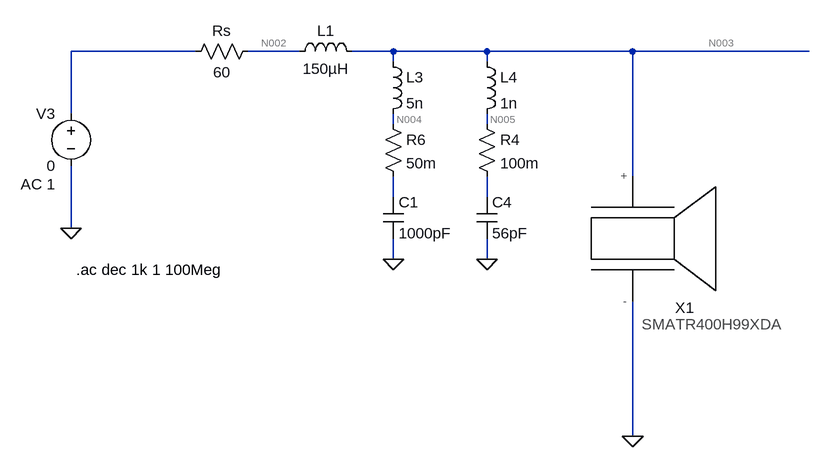
[diagram p0: schematic SMATR400H99XDA_Frequency_Response.asc]
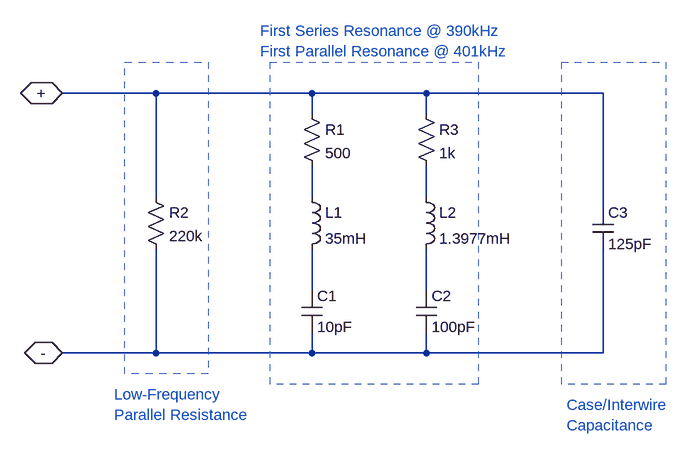
[diagram p1: sub-circuit smatr400h99xda.asc]
SMATR400H99XDA_Frequency_Response.asc, the LTspice schematic file:
Version 4
SHEET 1 4624 2852
WIRE -624 -128 -816 -128
WIRE -464 -128 -544 -128
WIRE -320 -128 -384 -128
WIRE -176 -128 -320 -128
WIRE 48 -128 -176 -128
WIRE 320 -128 48 -128
WIRE -320 -112 -320 -128
WIRE -176 -112 -176 -128
WIRE -816 -32 -816 -128
WIRE -320 -16 -320 -32
WIRE -176 -16 -176 -32
WIRE 48 64 48 -128
WIRE -320 96 -320 64
WIRE -176 96 -176 64
WIRE -816 144 -816 48
WIRE -320 192 -320 160
WIRE -176 192 -176 160
WIRE 48 464 48 256
FLAG 48 464 0
FLAG -816 144 0
FLAG -320 192 0
FLAG -176 192 0
SYMBOL SMATR400H99XDA 48 160 R0
SYMATTR InstName X1
SYMBOL voltage -816 -48 M0
WINDOW 123 24 124 Left 2
WINDOW 39 0 0 Left 0
SYMATTR Value2 AC 1
SYMATTR InstName V3
SYMATTR Value 0
SYMBOL cap -336 96 R0
SYMATTR InstName C1
SYMATTR Value 1000pF
SYMBOL ind -480 -112 R270
WINDOW 0 32 56 VTop 2
WINDOW 3 5 56 VBottom 2
SYMATTR InstName L1
SYMATTR Value 150µH
SYMBOL cap -192 96 R0
SYMATTR InstName C4
SYMATTR Value 56pF
SYMBOL ind -336 -128 R0
SYMATTR InstName L3
SYMATTR Value 5n
SYMBOL ind -192 -128 R0
SYMATTR InstName L4
SYMATTR Value 1n
SYMBOL res -192 -32 R0
SYMATTR InstName R4
SYMATTR Value 100m
SYMBOL res -336 -32 R0
SYMATTR InstName R6
SYMATTR Value 50m
SYMBOL res -640 -112 R270
WINDOW 0 32 56 VTop 2
WINDOW 3 0 56 VBottom 2
SYMATTR InstName Rs
SYMATTR Value 60
TEXT -808 208 Left 2 !.ac dec 1k 1 100Meg

smatr400h99xda.asc, the sub-circuit schematic file:
Version 4
SHEET 1 880 680
WIRE -160 -96 -304 -96
WIRE 80 -96 -160 -96
WIRE 256 -96 80 -96
WIRE 528 -96 256 -96
WIRE 80 -64 80 -96
WIRE 256 -64 256 -96
WIRE -160 64 -160 -96
WIRE 80 64 80 16
WIRE 256 64 256 16
WIRE 528 80 528 -96
WIRE 80 208 80 144
WIRE 256 208 256 144
WIRE -160 304 -160 144
WIRE -160 304 -304 304
WIRE 80 304 80 272
WIRE 80 304 -160 304
WIRE 256 304 256 272
WIRE 256 304 80 304
WIRE 528 304 528 144
WIRE 528 304 256 304
FLAG -304 -96 +
IOPIN -304 -96 BiDir
FLAG -304 304 -
IOPIN -304 304 BiDir
SYMBOL ind 64 48 R0
SYMATTR InstName L1
SYMATTR Value 35mH
SYMBOL res 64 -80 R0
SYMATTR InstName R1
SYMATTR Value 500
SYMBOL cap 64 208 R0
SYMATTR InstName C1
SYMATTR Value 10pF
SYMBOL res -176 48 R0
SYMATTR InstName R2
SYMATTR Value 220k
SYMBOL cap 240 208 R0
SYMATTR InstName C2
SYMATTR Value 100pF
SYMBOL res 240 -80 R0
SYMATTR InstName R3
SYMATTR Value 1k
SYMBOL ind 240 48 R0
SYMATTR InstName L2
SYMATTR Value 1.3977mH
SYMBOL cap 512 80 R0
SYMATTR InstName C3
SYMATTR Value 125pF
TEXT 0 -192 Left 2 ;First Series Resonance @ 390kHz\nFirst Parallel Resonance @ 401kHz
TEXT 472 384 Left 2 ;Case/Interwire\nCapacitance
TEXT -224 368 Left 2 ;Low-Frequency\nParallel Resistance
RECTANGLE Normal 336 352 16 -144 2
RECTANGLE Normal -80 336 -208 -144 2
RECTANGLE Normal 624 352 464 -144 2

The netlist it stands for:
* SMATR400H99XDA_Frequency_Response.asc
XX1 N003 0 smatr400h99xda
V3 N001 0 0 AC 1
C1 N006 0 1000pF
L1 N002 N003 150µH
C4 N007 0 56pF
L3 N003 N004 5n
L4 N003 N005 1n
R4 N005 N007 100m
R6 N004 N006 50m
Rs N001 N002 60

* block symbol definitions
.subckt smatr400h99xda + -
L1 N001 N003 35mH
R1 + N001 500
C1 N003 - 10pF
R2 + - 220k
C2 N004 - 100pF
R3 + N002 1k
L2 N002 N004 1.3977mH
C3 + - 125pF
* First Series Resonance @ 390kHz
* First Parallel Resonance @ 401kHz
* Case/Interwire
* Capacitance
* Low-Frequency
* Parallel Resistance
.ends smatr400h99xda

.ac dec 1k 1 100Meg
.backanno
.end

* Results of the author's LTspice run, read from the files saved beside the schematic
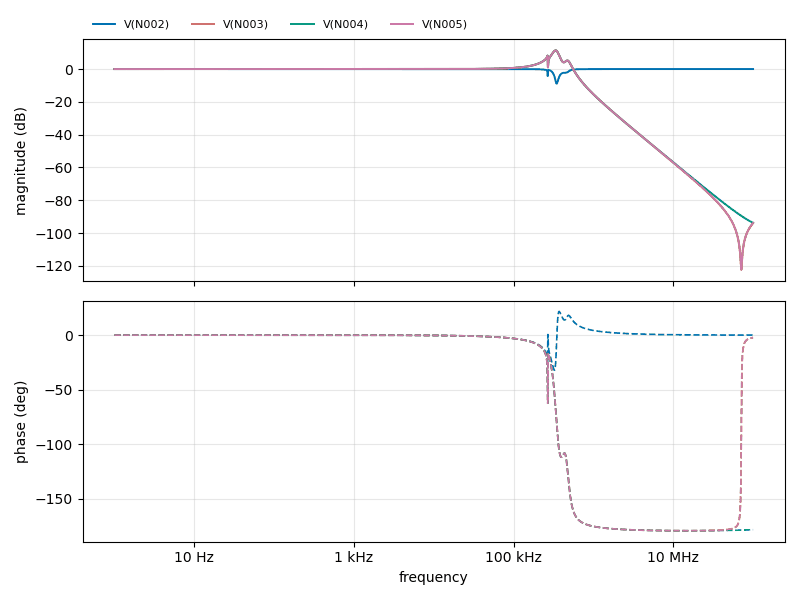
[diagram p2: AC Analysis of SMATR400H99XDA_Frequency_Response.asc, plotted from the saved traces]
* AC Analysis, 1 run:
*   V(N002): -0.00 dB at 1 Hz, -0.00 dB at 100 MHz, peak -0.00 dB at 100 MHz, 3 dB below the peak at 393.1 kHz
*   V(N003): -0.00 dB at 1 Hz, -93.98 dB at 100 MHz, peak 11.36 dB at 336.5 kHz, 3 dB below the peak at 294.7 kHz and 371.7 kHz
*   V(N004): -0.00 dB at 1 Hz, -93.75 dB at 100 MHz, peak 11.37 dB at 336.5 kHz, 3 dB below the peak at 294.7 kHz and 371.7 kHz
*   V(N005): -0.00 dB at 1 Hz, -93.78 dB at 100 MHz, peak 11.36 dB at 336.5 kHz, 3 dB below the peak at 294.7 kHz and 371.7 kHz